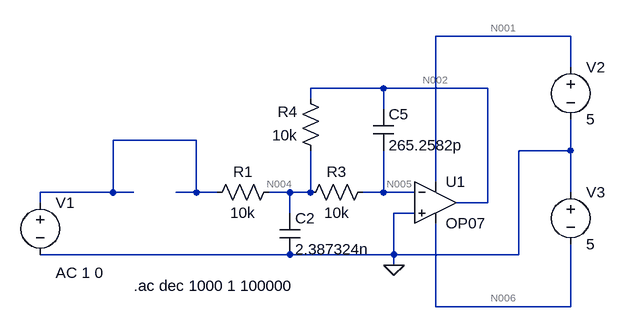
[diagram p0: schematic MultiFeedSchem.asc]
MultiFeedSchem.asc, the LTspice schematic file:
Version 4
SHEET 1 880 680
WIRE 480 -96 272 -96
WIRE 480 -48 480 -96
WIRE 192 -16 80 -16
WIRE 352 -16 192 -16
WIRE 80 0 80 -16
WIRE 192 16 192 -16
WIRE -96 64 -224 64
WIRE 480 80 480 32
WIRE 480 80 400 80
WIRE 272 128 272 -96
WIRE -224 144 -224 64
WIRE -224 144 -336 144
WIRE -192 144 -224 144
WIRE -96 144 -96 64
WIRE -96 144 -128 144
WIRE -64 144 -96 144
WIRE 48 144 16 144
WIRE 80 144 80 80
WIRE 80 144 48 144
WIRE 192 144 192 80
WIRE 192 144 160 144
WIRE 240 144 192 144
WIRE 480 144 480 80
WIRE -336 160 -336 144
WIRE 352 160 352 -16
WIRE 352 160 304 160
WIRE 48 176 48 144
WIRE 240 176 208 176
WIRE 48 240 -336 240
WIRE 208 240 208 176
WIRE 208 240 48 240
WIRE 400 240 400 80
WIRE 400 240 208 240
WIRE 208 256 208 240
WIRE 272 320 272 192
WIRE 480 320 480 224
WIRE 480 320 272 320
FLAG 208 256 0
SYMBOL Opamps\\OP07 272 96 R0
SYMATTR InstName U1
SYMBOL res 176 128 R90
WINDOW 0 0 56 VBottom 2
WINDOW 3 32 56 VTop 2
SYMATTR InstName R3
SYMATTR Value 10k
SYMBOL res 96 96 R180
WINDOW 0 36 76 Left 2
WINDOW 3 36 40 Left 2
SYMATTR InstName R4
SYMATTR Value 10k
SYMBOL res -80 160 R270
WINDOW 0 32 56 VTop 2
WINDOW 3 0 56 VBottom 2
SYMATTR InstName R1
SYMATTR Value 10k
SYMBOL cap 32 176 R0
SYMATTR InstName C2
SYMATTR Value 2.387324n
SYMBOL cap 176 16 R0
SYMATTR InstName C5
SYMATTR Value 265.2582p
SYMBOL voltage -336 144 R0
WINDOW 123 24 124 Left 2
WINDOW 39 0 0 Left 2
SYMATTR Value2 AC 1 0
SYMATTR InstName V1
SYMATTR Value ""
SYMBOL voltage 480 -64 R0
SYMATTR InstName V2
SYMATTR Value 5
SYMBOL voltage 480 128 R0
SYMATTR InstName V3
SYMATTR Value 5
TEXT -192 288 Left 2 !.ac dec 1000 1 100000

The netlist it stands for:
* MultiFeedSchem.asc
XU1 0 N005 N001 N006 N002 LT1001  ; OP07, pins In+ In- V+ V- OUT
R3 N005 N004 10k
R4 N004 N002 10k
R1 N003 N004 10k
C2 N004 0 2.387324n
C5 N002 N005 265.2582p
V1 N003 0 AC 1 0
V2 N001 0 5
V3 0 N006 5
.ac dec 1000 1 100000
.lib LTC.lib
.backanno
.end

* Results of the author's LTspice run, read from the files saved beside the schematic
* Operating Point, zero values left out:
*   V(n001) = 5 V
*   V(n006) = -5 V
*   I(V3) = -2.25 mA
*   I(V2) = -2.25 mA
*   Ix(u1:3) = 2.25 mA
*   Ix(u1:4) = -2.25 mA
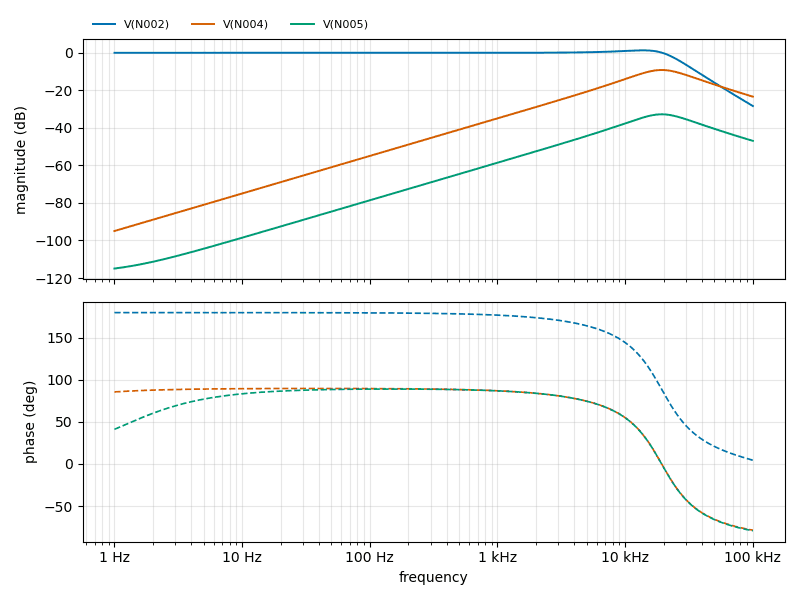
[diagram p1: AC Analysis of MultiFeedSchem.asc, plotted from the saved traces]
* AC Analysis, 1 run:
*   V(N002): -0.00 dB at 1 Hz, -28.35 dB at 100 kHz, peak 1.31 dB at 13.8 kHz, 3 dB below the peak at 22.63 kHz
*   V(N004): -94.95 dB at 1 Hz, -23.36 dB at 100 kHz, peak -9.15 dB at 19.32 kHz, 3 dB below the peak at 12 kHz and 31.12 kHz
*   V(N005): -114.96 dB at 1 Hz, -46.92 dB at 100 kHz, peak -32.77 dB at 19.32 kHz, 3 dB below the peak at 12.01 kHz and 31.13 kHz